# Altium schematic sheet MAX232.SchDoc
size A4
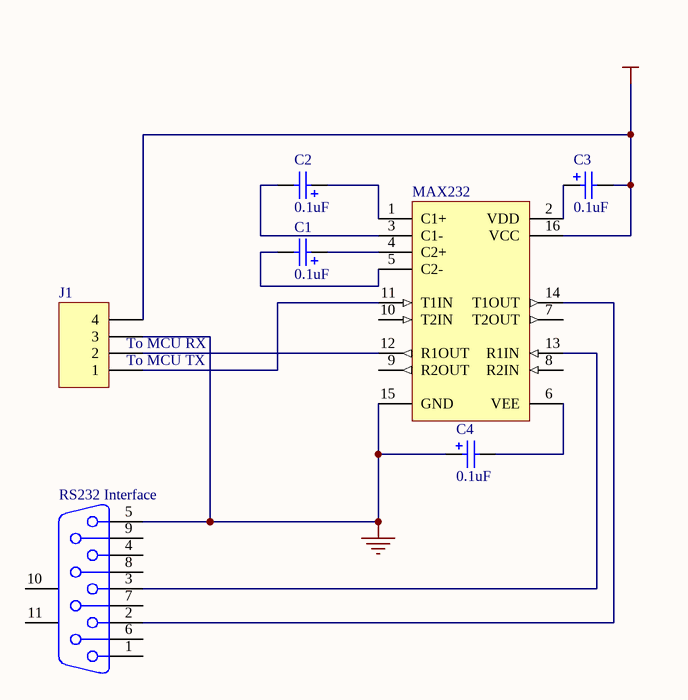
[diagram p0: MAX232.SchDoc]

## Parts
C1  value 0.1uF  [CC2012-0805]  (hidden comment: Cap Pol3)
C2  value 0.1uF  [CC2012-0805]  (hidden comment: Cap Pol3)
C3  value 0.1uF  [CC2012-0805]  (hidden comment: Cap Pol3)
C4  value 0.1uF  [CC2012-0805]  (hidden comment: Cap Pol3)
J1  Header 4  [HDR1X4]  (value not drawn)
MAX232  MAX232CSE  [NSO16]  (value not drawn)
RS232_Interface  D Connector 9  [DSUB1.385-2H9]  (value not drawn)

## Nets
GND: C4.1 J1.3 MAX232.15(GND) RS232_Interface.5
VCC: C3.2 J1.4 MAX232.16(VCC)
NetC1_1: C1.1 MAX232.4(C2+)
NetC1_2: C1.2 MAX232.5(C2-)
NetC2_1: C2.1 MAX232.1(C1+)
NetC2_2: C2.2 MAX232.3(C1-)
NetC3_1: C3.1 MAX232.2(VDD)
NetC4_2: C4.2 MAX232.6(VEE)
NetJ1_1: J1.1 MAX232.11(T1IN)
NetJ1_2: J1.2 MAX232.12(R1OUT)
NetMAX232_13: MAX232.13(R1IN) RS232_Interface.3
NetMAX232_14: MAX232.14(T1OUT) RS232_Interface.2

Not connected (* = marked no-connect by the designer): MAX232 7(T2OUT) 8(R2IN) 9(R2OUT) 10(T2IN); RS232_Interface 1 4 6 7 8 9 10(MH1) 11(MH2)

## Notes on the sheet
- (near J1) To MCU RX
- (near J1) To MCU TX

## Library data of the parts
C1-C4 = Cap Pol3: Polarized Capacitor (Surface Mount); Published: 8-Jun-2000; Revision: July-2002: Re-released for DXP Platform.; Publisher: Altium Limited
J1 = Header 4: Header, 4-Pin; Revision: 17-Jul-2002: Re-released for DXP Platform.; Publisher: Altium Limited
MAX232 = MAX232CSE: +5V Powered, Multi-Channel RS-232 Driver/Receiver; Code - JEDEC: MS-012-AC; Code - IPC: SO16; Published: 16-Jan-2001; Revision: 17-Jul-2002: Re-released for DXP Platform.; Package Reference: NSO16; Publisher: Altium Limited
RS232_Interface = D Connector 9: Receptacle Assembly, 9 Position, Right Angle; Package Information: Latest Revision: O; Positions: 9; Published: 15-Jun-2001; Revision: 17-Jul-2002: Re-released for DXP Platform.; Datasheet: (1-Sep-1999); Package Reference: 788750; Publisher: Altium Limited; Orientation: Right Angle; Gender: Receptacle